# EasyEDA Pro project EasyEDAproject_AngstromIO_Mini_Devboard_2026-03-15.epro, board AngstromIO devboard only
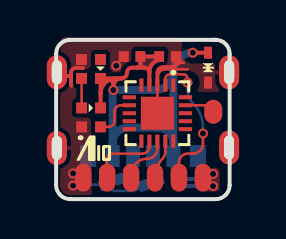
[diagram p7: board, top side]
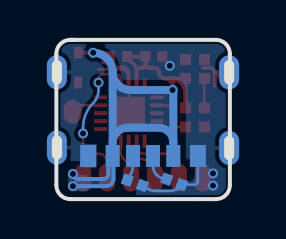
[diagram p8: board, bottom side, seen from below]

Outline 8.7 x 8 mm; copper layers: Top Layer, Bottom Layer. Coordinates in mm from the lower left corner of the outline.
Outline path: 8,8 0.7,8 arc(0.21,7.79) 0,7.3 0,0.7 arc(0.21,0.21) 0.7,0 1.59,0 8,0 arc(8.49,0.21) 8.7,0.7 8.7,7.3 arc(8.49,7.79) 8,8 ; 8,8 7.79,8
Stack: Top Layer 0.035mm / Dielectric1 1.51mm FR4 er 4.5 / Bottom Layer 0.035mm

## Design rules (mm)
template: Custom Config
spacing copperThickness1oz (default): track to track 0.102, other pairs 0.152 to 0.3
spacing copperThickness2oz: track to track 0.203, other pairs 0.152 to 0.3
track width copperThickness1oz (default): min 0.127, default 0.254, max 2.54
track width copperThickness2oz: min 0.203, default 0.254, max 2.54
differential pair differentialPair (default): width min 0.127, default 0.254, max 2.54; gap min 0.152, default 0.152
via viaSize (default): diameter min 0.5, default 0.61, max 10; hole min 0.3, default 0.305, max 6.3
pour e219 uses copperRegion
pour e220 uses copperRegion

## Placement (name value [footprint] x y rotation side)
C6  10uF  [C0402]  3.81 7.16 0 top
C7  100nF  [C0402]  5.58 7.16 0 top
D2  LESD5D5.0CT1G  [SOD-523_L1.2-W0.8-LS1.6-BI]  7.62 6.6 90 top
LED22  SK6805-EC15  [LED-SMD_4P-L1.5-W1.5-BL]  1.75 4.1 90 top
LED23  SK6805-EC15  [LED-SMD_4P-L1.5-W1.5-BL]  1.75 6.53 0 top
NOREF  -  [Pad_e206]  4.96 1.08 0 top
NOREF#2  -  [Pad_e204]  2.56 1.08 0 top
NOREF#3  -  [Pad_e205]  3.76 1.08 0 top
NOREF#4  -  [Pad_e203]  1.36 1.08 0 top
NOREF#5  -  [Pad_e202]  7.36 1.08 0 top
NOREF#6  -  [Pad_e207]  6.16 1.08 0 top
NOREF#7  -  [Pad_e201]  7.88 4.39 0 top
R11  5.1K  [thinner 0402]  4.76 0.82 20 bottom
R12  5.1K  [thinner 0402]  2.79 0.87 20 bottom
U3  ATTINY1616-MNR  [QFN-20_L3.0-W3.0-P0.40-BL-EP1.7]  5.08 4.31 180 top
USB  TYPE-C 6P(073)  [USB C one pad removed]  4.35 4.24 0 bottom

## Footprints (pads in the part's own frame, mm; a bottom-side part is the same pattern mirrored in y, then rotated)
C0402
  rect 0.5x0.54 smd: 1(-0.42,0) 2(0.42,0)
LED-SMD_4P-L1.5-W1.5-BL
  rect 0.55x0.55 smd: 1(-0.475,-0.475) 2(0.475,-0.475) 3(0.475,0.475) 4(-0.475,0.475)
Pad_e201
  rrect 0.9x1.2 smd: 1(0,0)
Pad_e202
  rrect 0.82x1.4 smd: 1(0,0)
Pad_e203
  rrect 0.82x1.4 smd: 1(0,0)
Pad_e204
  rrect 0.82x1.4 smd: 1(0,0)
Pad_e205
  rrect 0.82x1.4 smd: 1(0,0)
Pad_e206
  rrect 0.82x1.4 smd: 1(0,0)
Pad_e207
  rrect 0.82x1.4 smd: 1(0,0)
QFN-20_L3.0-W3.0-P0.40-BL-EP1.7
  rect 0.2x0.665 smd: 1(-0.8,-1.407) 2(-0.4,-1.407) 3(0,-1.407) 4(0.4,-1.407) 5(0.8,-1.407) 11(0.8,1.407) 12(0.4,1.407) 13(0,1.407) 14(-0.4,1.407) 15(-0.8,1.407)
  rect 0.665x0.2 smd: 6(1.407,-0.8) 7(1.407,-0.4) 8(1.407,0) 9(1.407,0.4) 10(1.407,0.8) 16(-1.407,0.8) 17(-1.407,0.4) 18(-1.407,0) 19(-1.407,-0.4) 20(-1.407,-0.8)
  rect 1.65x1.65 smd: 21(0,0)
SOD-523_L1.2-W0.8-LS1.6-BI
  rect 0.6x0.4 smd: 1(-0.75,0) 2(0.75,0)
thinner 0402
  rect 0.5x0.54 smd: 1(-0.403,0) 2(0.402,0)
USB C one pad removed
  oval 1x1.7 hole 0.5x1.2: 7(-4.32,-2.125) 7(-4.32,1.675) 7(4.318,1.651) 7(4.32,-2.125)
  rect 0.7x1.1 smd: A5(-0.5,2.075) A9(1.52,2.075) B5(0.5,2.075) B9(-1.52,2.075)
  rect 0.8x1.1 smd: A12(2.75,2.075) B12(-2.75,2.075)

## Nets
+5V: C6.2 C7.1 D2.2 LED22.2 LED23.2 NOREF#5.1 U3.4 USB.A9 USB.B9
GND: C6.1 C7.2 D2.1 LED22.4 LED23.4 NOREF#4.1 R11.1 R12.1 U3.3 U3.21 USB.7 USB.A12 USB.B12
D: LED22.1 U3.7
PA3: NOREF#6.1 U3.2
PB2: NOREF#2.1 U3.12
SCL: NOREF.1 U3.14
SDA: NOREF#3.1 U3.13
UPDI: NOREF#7.1 U3.19
$1N8336: R12.2 USB.A5
$1N8340: R11.2 USB.B5
$1N8511: LED22.3 LED23.1

Pads without a net: LED23 3; U3 1 5 6 8 9 10 11 15 16 17 18 20

## Via types
v1: diameter 0.5, hole 0.305, Top Layer to Bottom Layer, 9 vias

## Routing (per net, layer and track width the routed paths; a pad name or vN(x,y) marks a point on that pad's centre or on a via; arc(x,y) is an arc through that point)
+5V: length 34.1
  Top Layer w0.2: 4.23,6.8 C6.2 5.16,7.16 ; 4.23,6.8 arc(4.28,6.66) 4.42,6.6 ; 4.23,6.8 arc(4.17,6.66) 4.03,6.6 ; 2.99,6.06 2.22,6.06 arc(2.23,6.06) 2.23,6.05 2.23,5.3 ; 2.99,6.06 3.27,6.06 ; 2.99,6.06 arc(2.83,6.04) 2.67,5.99 ; 4.03,6.6 3.81,6.6 arc(3.63,6.53) 3.55,6.35 arc(3.47,6.14) 3.27,6.06 ; 4.03,6.6 4.42,6.6 ; 4.42,6.6 arc(4.6,6.53) 4.68,6.35 ; U3.4 4.68,6.35 ; 4.68,6.35 4.68,6.4 arc(4.85,6.82) 5.27,6.99 ; v1(2.87,5.48) 2.87,5.66 ; 2.87,5.66 2.87,5.78 arc(2.81,5.93) 2.67,5.99 ; 2.87,5.66 arc(2.99,5.94) 3.27,6.06 ; 2.23,5.3 LED22.2 ; 2.23,5.3 arc(2.35,5.7) 2.67,5.99 ; v1(6.85,7.35) D2.2
  Bottom Layer w0.2: v1(7.87,0.65) 6.2,0.65 arc(5.94,0.76) 5.84,1.01 5.84,2.08 arc(5.85,2.11) 5.88,2.12 arc(6.03,2.05) 6.09,1.9 6.09,1.27 arc(6.17,1.09) 6.35,1.01 7.61,1.01 arc(7.8,1.09) v1(7.87,1.27)
  Bottom Layer w0.4: 2.83,2.12 2.83,2.84 ; 2.83,2.84 2.83,5.44 arc(2.84,5.47) v1(2.87,5.48) 4.98,5.48 arc(5.61,5.74) 5.88,6.37 ; 2.83,2.84 arc(3.05,3.37) 3.58,3.59 5.13,3.59 arc(5.66,3.37) 5.88,2.84 ; 5.88,2.84 5.88,6.37 ; 5.88,2.84 5.88,2.12 ; 5.88,6.37 arc(6.16,7.06) v1(6.85,7.35)
GND: length 12.5
  Top Layer w0.127: U3.21 U3.3 ; 5.98,6.51 5.46,6.51 arc(5.21,6.41) 5.1,6.16 ; 5.98,6.51 6.6,6.51 ; 5.98,6.51 arc(5.9,6.55) 5.87,6.63
  Top Layer w0.13: 6.29,6.9 6.28,6.91 arc(6.21,6.95) 6.12,6.97 ; D2.1 7.62,5.99 ; 6.04,6.94 6.06,6.92 arc(6.13,6.88) 6.2,6.86 ; 6.41,6.85 arc(6.15,6.8) 5.94,6.66
  Top Layer w0.18: 6,7.16 6,6.84 arc(5.94,6.69) 5.79,6.63 5.36,6.63 arc(5.16,6.54) 5.08,6.35 U3.3
  Top Layer w0.2: 1.36,6.59 1,6.59 arc(0.82,6.51) 0.75,6.33 0.75,5.78 arc(0.75,5.74) 0.76,5.69 ; 0.4,6.18 0.68,6.18 arc(0.7,6.18) 0.72,6.19
  Bottom Layer w0.127: 2.38,0.72 2.45,0.65 arc(2.72,0.47) 3.03,0.41 3.72,0.41 arc(4.07,0.48) 4.36,0.67 ; R12.1 1.77,0.73 arc(1.65,0.78) 1.6,0.9 1.6,2.12
  vias: v1(0.85,1.29) v1(0.85,0.68) v1(3.01,6.7)
D: length 2.3
  Top Layer w0.127: 2.23,3.63 2.63,3.63 arc(2.84,3.71) 2.92,3.92 2.92,4.39 arc(3.02,4.62) 3.24,4.71 U3.7
PA3: length 7.5
  Top Layer w0.127: NOREF#6.1 6.16,1.84 arc(6.29,2.15) 6.6,2.28 6.85,2.28 arc(7.21,2.43) 7.36,2.79 v1(7.36,3.3) ; v1(6.58,5.85) 6.58,6.07 ; U3.2 5.48,5.87 ; 5.47,6.02 arc(5.54,6.2) 5.72,6.27 6.38,6.27 arc(6.52,6.21) 6.58,6.07
  Bottom Layer w0.127: v1(6.58,5.85) 6.58,5.47 arc(6.65,5.12) 6.85,4.82 arc(7.23,4.26) 7.36,3.59 v1(7.36,3.3)
PB2: length 3.7
  Top Layer w0.127: U3.12 4.68,2.64 arc(4.57,2.39) 4.31,2.28 2.79,2.28 arc(2.61,2.21) 2.54,2.03 2.54,1.1 arc(2.54,1.09) NOREF#2.1
SCL: length 1.9
  Top Layer w0.127: 5.03,1.12 5.03,1.29 arc(5.11,1.69) 5.33,2.03 arc(5.44,2.19) 5.48,2.38 U3.14
SDA: length 2.6
  Top Layer w0.127: U3.13 5.08,2.54 arc(4.93,2.18) 4.57,2.03 arc(4,1.79) 3.76,1.22 NOREF#3.1
UPDI: length 1.5
  Top Layer w0.127: U3.19 7.77,4.71 arc(7.87,4.67) 7.91,4.57
$1N8336: length 1.5
  Bottom Layer w0.127: 3.85,2.12 3.85,1.65 arc(3.81,1.42) 3.68,1.23 3.66,1.21 arc(3.45,1.07) 3.2,1.02
$1N8340: length 1.2
  Bottom Layer w0.127: 4.85,2.12 4.85,1.73 arc(4.94,1.32) 5.17,0.97
$1N8511: length 1.5
  Top Layer w0.127: LED22.3 1.28,6.05 arc(1.28,6.06) 1.27,6.06

## Copper pours and planes (outline as drawn; the poured copper is in the pictures)
+5V on Top Layer: 7.27,1.56 8.2,1.56 8.2,0.38 7.27,0.38
+5V on Bottom Layer: 5.84,1.74 8.12,1.74 8.12,0.4 5.84,0.4
+5V on Bottom Layer: 2.83,6.11 5.88,6.11 5.88,3.19 2.83,3.19
GND on Top Layer: -0.26,8.63 8.68,8.63 8.68,0 -0.26,0
GND on Top Layer: 0.34,8.12 6.31,8.12 6.31,7.65 0.34,7.65
GND on Bottom Layer: -0.42,8.16 8.97,8.16 8.97,-0.47 -0.42,-0.47

Small or netless copper shapes (teardrops, artwork), in the pictures only: 3 on Top Layer, 1 on Bottom Layer
